# Altium schematic sheet analog_filter.SchDoc
size A4; SheetNumber: 3; SheetTotal: 5
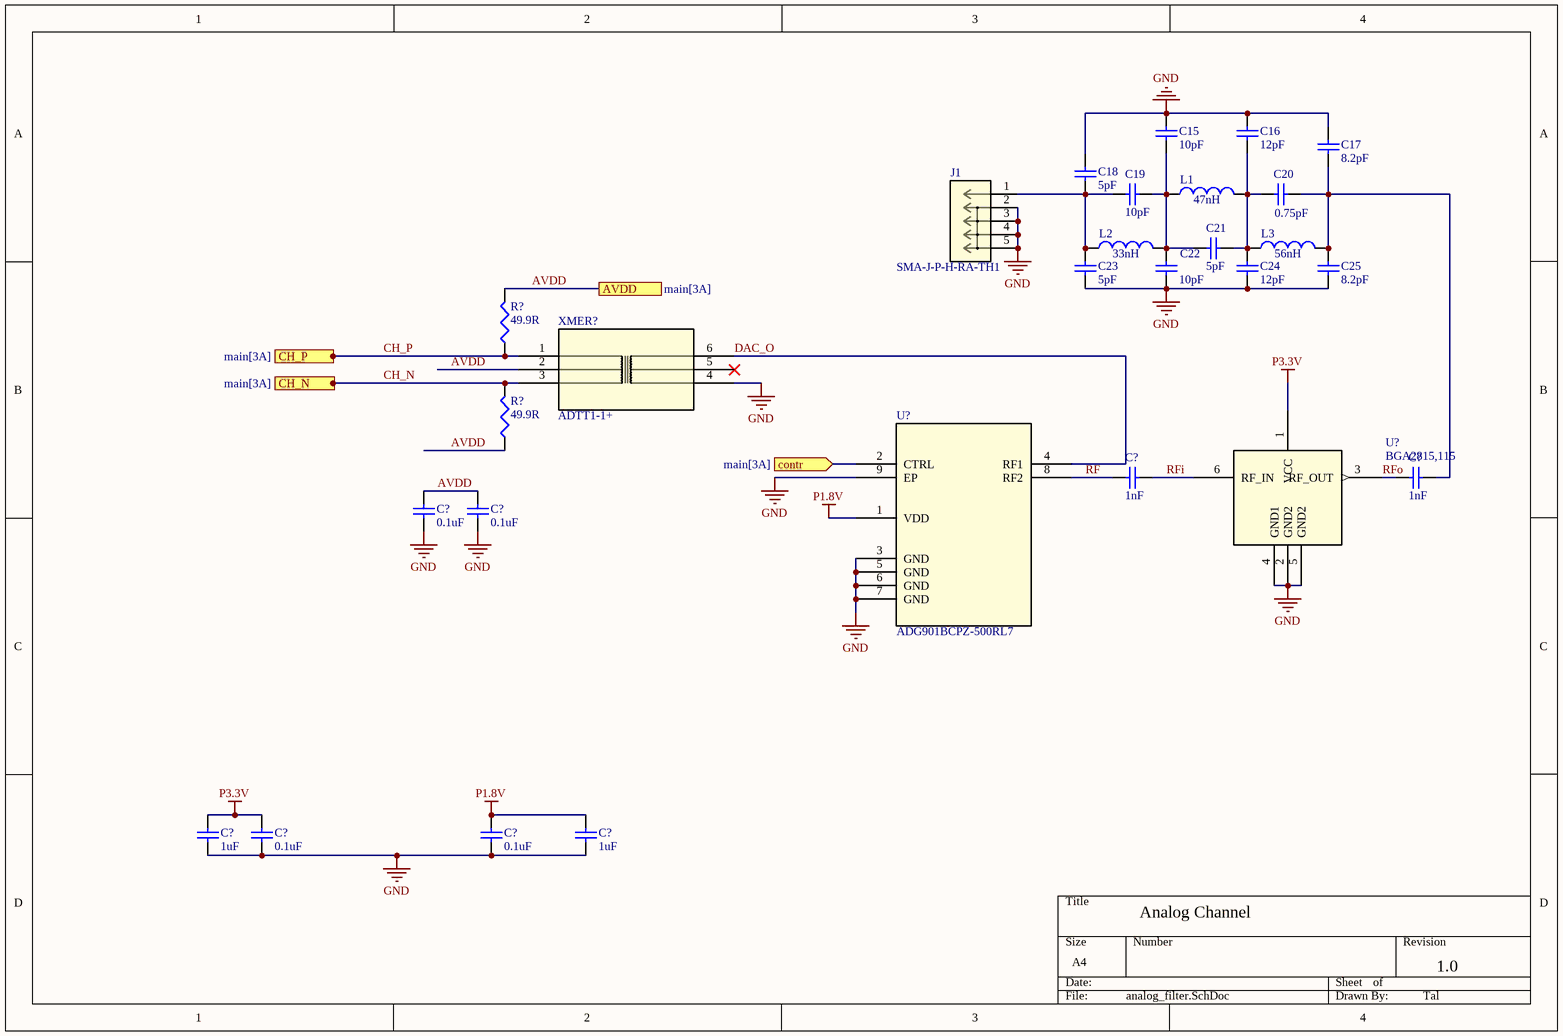
[diagram p0: analog_filter.SchDoc]

## Parts
(Parts that share a designator on the sheet are numbered #1, #2 ... from top to bottom, then left to right.)
C15  Capacitance: 10pF  [C0402]  (hidden comment: 10pF 50V)
C16  Capacitance: 12pF  [C0402]  (hidden comment: 12pF 50V)
C17  Capacitance: 8.2pF  [C0402]  (hidden comment: 8.2pF 50V)
C18  Capacitance: 5pF  [C0402]  (hidden comment: 10pF 50V)
C19  Capacitance: 10pF  [C0402]  (hidden comment: 12pF 50V)
C20  Capacitance: 0.75pF  [C0402]  (hidden comment: 8.2pF 50V)
C21  Capacitance: 5pF  [C0402]  (hidden comment: 5pF 50V)
C22  Capacitance: 10pF  [C0402]  (hidden comment: 10pF 50V)
C23  Capacitance: 5pF  [C0402]  (hidden comment: 0.75pF 50V)
C24  Capacitance: 12pF  [C0402]  (hidden comment: 5pF 50V)
C25  Capacitance: 8.2pF  [C0402]  (hidden comment: 10pF 50V)
C?#1  Capacitance: 1nF  [C0402]  (hidden comment: 1nF 25V)
C?#2  Capacitance: 1nF  [C0402]  (hidden comment: 1nF 25V)
C?#3  Capacitance: 0.1uF  [C0402]  (hidden comment: 0.1uF 50V)
C?#4  Capacitance: 0.1uF  [C0402]  (hidden comment: 0.1uF 50V)
C?#5  Capacitance: 1uF  [C0402]  (hidden comment: 1uF 25V)
C?#6  Capacitance: 0.1uF  [C0402]  (hidden comment: 0.1uF 50V)
C?#7  Capacitance: 0.1uF  [C0402]  (hidden comment: 0.1uF 50V)
C?#8  Capacitance: 1uF  [C0402]  (hidden comment: 1uF 25V)
J1  SMA-J-P-H-RA-TH1  [CONN_SMA-J-P-H-RA-TH1_SAI]
L1  value 47nH  [0402-A]  (hidden comment: Inductor)
L2  value 33nH  [0402-A]  (hidden comment: Inductor)
L3  value 56nH  [0402-A]  (hidden comment: Inductor)
R?#1  49.9R  [R0402]
R?#2  49.9R  [R0402]
U?#1  ADG901BCPZ-500RL7  [CP_8_2_ADI]
U?#2  BGA2815,115  [SOT_2815,115_NXP]
XMER?  ADTT1-1+  [CD542_MNC]

## Ports
AVDD (see main[3A]), CH_N (in, see main[3A]), CH_P (in, see main[3A]), contr (in, see main[3A])

## Nets
GND: C15.2 C16.2 C17.2 C18.2 C22.1 C23.1 C24.1 C25.1 C?#3.1 C?#4.1 C?#5.1 C?#6.1 C?#7.1 C?#8.1 J1.2 J1.3 J1.4 J1.5 U?#1.3(GND) U?#1.5(GND) U?#1.6(GND) U?#1.7(GND) U?#1.9(EP) U?#2.2(GND2) U?#2.4(GND1) U?#2.5(GND2) XMER?.4
P1.8V: C?#7.2 C?#8.2 U?#1.1(VDD)
P3.3V: C?#5.2 C?#6.2 U?#2.1(VCC)
AVDD: C?#3.2 C?#4.2 R?#1.2 R?#2.1 XMER?.2 ; port AVDD
CH_N: R?#2.2 XMER?.3 ; port CH_N
CH_P: R?#1.1 XMER?.1 ; port CH_P
contr: U?#1.2(CTRL) ; port contr
DAC_O: U?#1.4(RF1) XMER?.6
RF: C?#1.1 U?#1.8(RF2)
RFi: C?#1.2 U?#2.6(RF_IN)
RFo: C?#2.1 U?#2.3(RF_OUT)
NetC15_1: C15.1 C19.1 C21.2 C22.2 L1.1 L2.2
NetC16_1: C16.1 C20.1 C21.1 C24.2 L1.2 L3.1
NetC17_1: C17.1 C20.2 C25.2 C?#2.2 L3.2
NetC18_1: C18.1 C19.2 C23.2 J1.1 L2.1

Not connected (* = marked no-connect by the designer): XMER? 5*

## Notes on the sheet
- Analog Channel
- 1.0
- Tal

## Library data of the parts
C15 C19 C22 = CAP CER 20pF 50V 5% NP0 0402: CAP CER 10PF 50V 5% NP0 0402; Manufacturer: TDK Corporation; Manufacturer Part Number: C1005C0G1H200J; LANDA P/N: ECP-000034; Package / Case: 0402 (1005 Metric); RoHS: RoHS Compliant; ComponentLink1URL: http://www.tdk.com/pdf/general_B11.pdf; ComponentLink1Description: http://www.tdk.com/pdf/general_B11.pdf; Voltage - Rated: 50V
C16 C24 = CAP CER 20pF 50V 5% NP0 0402: CAP CER 12PF 50V 5% NP0 0402; Manufacturer: TDK Corporation; Manufacturer Part Number: C1005C0G1H200J; LANDA P/N: ECP-000034; Package / Case: 0402 (1005 Metric); RoHS: RoHS Compliant; ComponentLink1URL: http://www.tdk.com/pdf/general_B11.pdf; ComponentLink1Description: http://www.tdk.com/pdf/general_B11.pdf; Voltage - Rated: 50V
C17 C25 = CAP CER 20pF 50V 5% NP0 0402: CAP CER 8.2PF 50V 5% NP0 0402; Manufacturer: TDK Corporation; Manufacturer Part Number: C1005C0G1H200J; LANDA P/N: ECP-000034; Package / Case: 0402 (1005 Metric); RoHS: RoHS Compliant; ComponentLink1URL: http://www.tdk.com/pdf/general_B11.pdf; ComponentLink1Description: http://www.tdk.com/pdf/general_B11.pdf; Voltage - Rated: 50V
C18 C21 C23 = CAP CER 20pF 50V 5% NP0 0402: CAP CER 5PF 50V 5% NP0 0402; Manufacturer: TDK Corporation; Manufacturer Part Number: C1005C0G1H200J; LANDA P/N: ECP-000034; Package / Case: 0402 (1005 Metric); RoHS: RoHS Compliant; ComponentLink1URL: http://www.tdk.com/pdf/general_B11.pdf; ComponentLink1Description: http://www.tdk.com/pdf/general_B11.pdf; Voltage - Rated: 50V
C20 = CAP CER 20pF 50V 5% NP0 0402: CAP CER 0.75PF 50V 5% NP0 0402; Manufacturer: TDK Corporation; Manufacturer Part Number: C1005C0G1H200J; LANDA P/N: ECP-000034; Package / Case: 0402 (1005 Metric); RoHS: RoHS Compliant; ComponentLink1URL: http://www.tdk.com/pdf/general_B11.pdf; ComponentLink1Description: http://www.tdk.com/pdf/general_B11.pdf; Voltage - Rated: 50V
C?#1 C?#2 = CAP CER 33nF 25V 10% X7R 0402: CAP CER 1nF 25V 10% X7R 0402; Manufacturer Part Number: C1005X7R1E333K; Manufacturer: TDK Corporation; LANDA P/N: ECP-000045; RoHS: RoHS Compliant; Package / Case: 0402 (1005 Metric); ComponentLink1URL: http://www.tdk.com/pdf/general_B11.pdf; ComponentLink1Description: http://www.tdk.com/pdf/general_B11.pdf; Voltage - Rated: 25V
C?#3 C?#4 C?#6 C?#7 = CAP CER 6.8pF 50V NP0 0402: CAP CER 0.1uF 50V NP0 0402; Manufacturer Part Number: C1005C0G1H6R8D; Manufacturer: TDK Corporation; LANDA P/N: ECP-000033; RoHS: RoHS Compliant; Package / Case: 0402 (1005 Metric); ComponentLink1URL: http://www.tdk.com/pdf/general_B11.pdf; ComponentLink1Description: http://www.tdk.com/pdf/general_B11.pdf; Voltage - Rated: 50V
C?#5 C?#8 = CAP CER 6.8pF 50V NP0 0402: CAP CER 1uF 25V X5R 0402; Manufacturer Part Number: C1005C0G1H6R8D; Manufacturer: TDK Corporation; LANDA P/N: ECP-000033; Voltage - Rated: 50V; RoHS: RoHS Compliant; Package / Case: 0402 (1005 Metric); ComponentLink1URL: http://www.tdk.com/pdf/general_B11.pdf; ComponentLink1Description: http://www.tdk.com/pdf/general_B11.pdf
J1 = SMA-J-P-H-RA-TH1: No Description Available; Mfr_Name: Samtec Inc; Copyright: Copyright (C) 2023 Ultra Librarian. All rights reserved.; Manufacturer_Part_Number: SMA-J-P-H-RA-TH1; RefDes: RefDes; Type: DEV
L1-L3 = Inductor: Code_IEC: 1005; Published: 8-Jun-2000; LatestRevisionDate: 29-May-2009; LatestRevisionNote: IPC-7351 Footprint Added.; PackageReference: 0402-A; Publisher: Altium Limited; PackageDescription: Chip Inductor; Code_JEITA: 0402
R?#1 R?#2 = RES 100 OHM 1/10W 1% 0402 SMD: RES 49.9 OHM 1/10W 1% 0402 SMD; Manufacturer Part Number: ERJ-2RKF1000X; Manufacturer: Panasonic Electronic Components; LANDA P/N: ERS-000079; Assembly: N.C; Package / Case: 0402 (1005 Metric); RoHS: RoHS Compliant; ComponentLink1URL: http://industrial.panasonic.com/www-cgi/jvcr13pz.cgi?E+PZ+3+AOA0002+ERJ2RKF1000X+7+WW; ComponentLink1Description: http://industrial.panasonic.com/www-cgi/jvcr13pz.cgi?E+PZ+3+AOA0002+ERJ2RKF1000X+7+WW; Supplier Device Package: 0402
U?#1 = ADG901BCPZ-500RL7: No Description Available; Mfr_Name: Analog Devices Inc; Copyright: Copyright (C) 2023 Ultra Librarian. All rights reserved.; Manufacturer_Part_Number: ADG901BCPZ-500RL7; RefDes: RefDes; Type: DEV
U?#2 = BGA2815,115: No Description Available; Mfr_Name: NXP; Copyright: Copyright (C) 2023 Ultra Librarian. All rights reserved.; Manufacturer_Part_Number: BGA2815,115; RefDes: RefDes; Type: DEV
XMER? = ADTT1-1+: No Description Available; Mfr_Name: Mini Circuits; Copyright: Copyright (C) 2023 Ultra Librarian. All rights reserved.; Manufacturer_Part_Number: ADTT1-1+; RefDes: RefDes; Type: DEV